# EasyEDA Pro project DC_MainBoard_Gh.eprj

# Schematic Schematic1
Board Name: Board1; Create Date: 2025-06-30; Page Name: P1; Project Name: DC_MainBoard_Gh; Schematic Name: Schematic1; Update Date: 2025-07-02; Company: EasyEDA.com; Page Size: A4; Version: V1.0
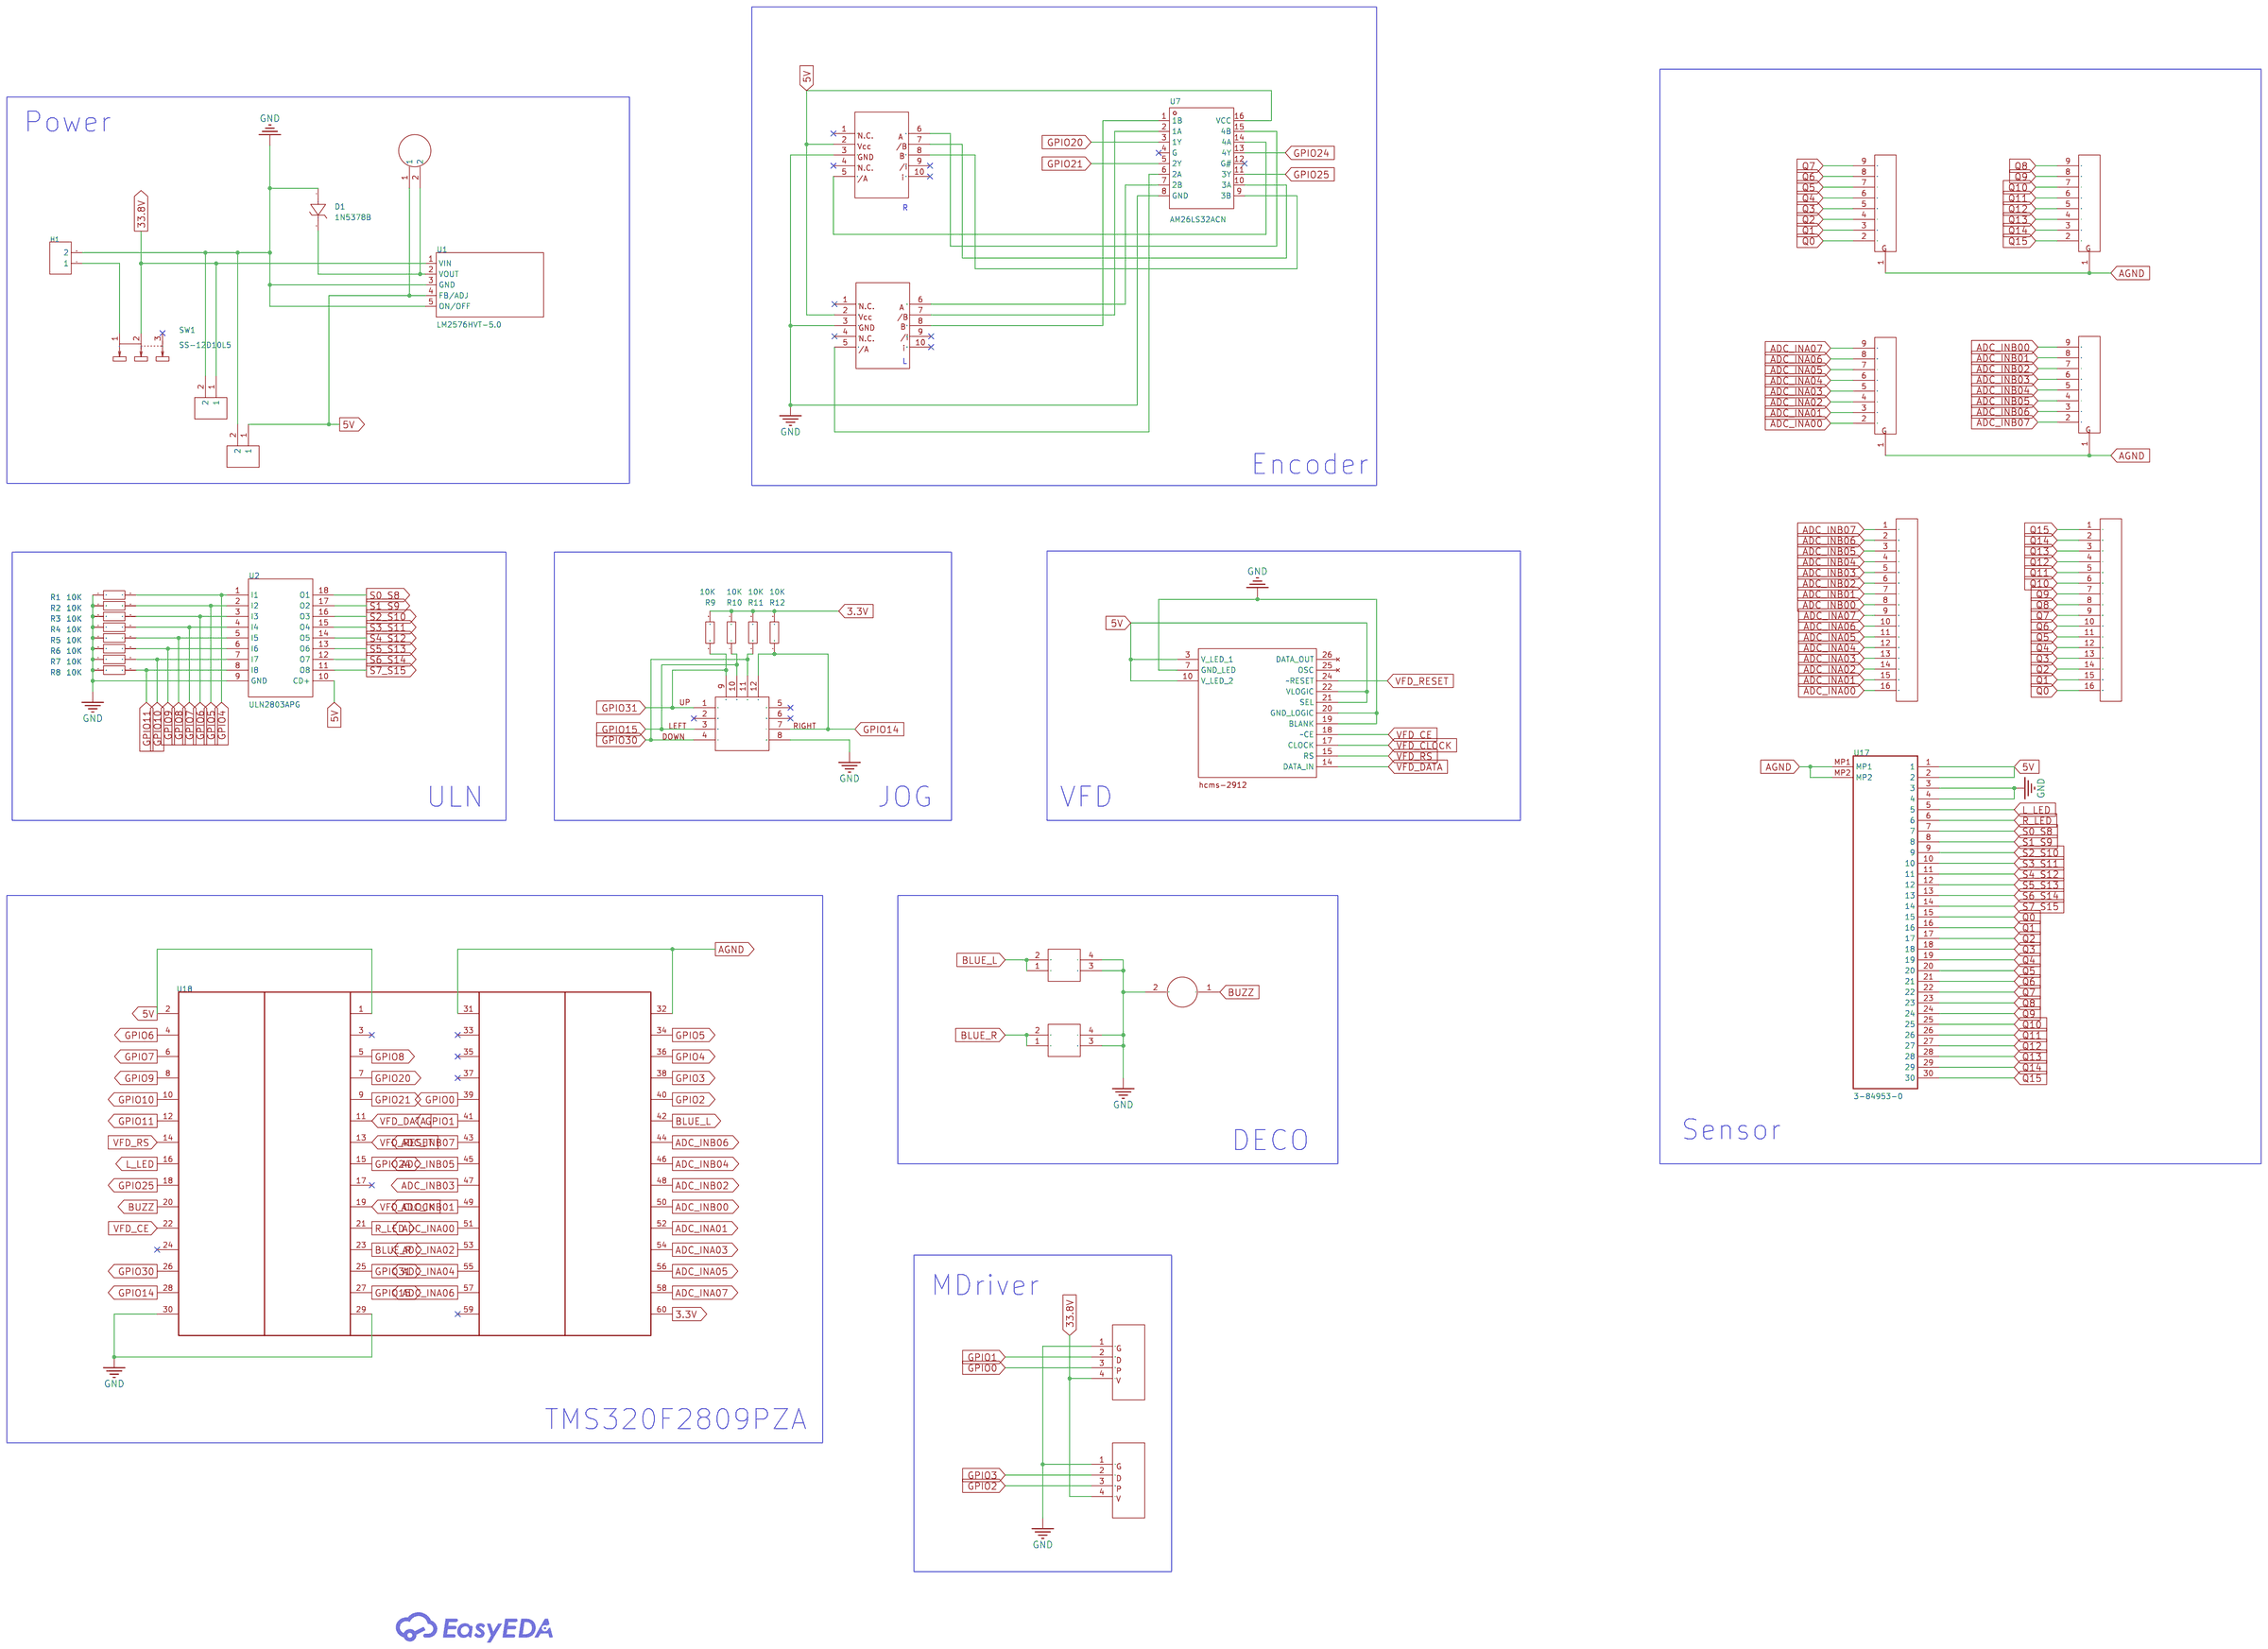
[diagram p0: schematic sheet]

## Parts
C1  -  [100uF Capacitor]
C2  -  [1000uF Capacitor]
D1  1N5378B  [DO-15_BD3.1-L6.7-P10.70-D0.9-FD]
H1  -  [HDR-TH_2P-P2.54-V-F]
L1  -  [Indoctor]
L2  -  [NEMO_LED]
L3  -  [NEMO_LED]
R1  10K  [R0603]
R2  10K  [R0603]
R3  10K  [R0603]
R4  10K  [R0603]
R5  10K  [R0603]
R6  10K  [R0603]
R7  10K  [R0603]
R8  10K  [R0603]
R9  10K  [R0603]
R10  10K  [R0603]
R11  10K  [R0603]
R12  10K  [R0603]
SW1  SS-12D10L5  [SW-TH_SS-12D10L5]
U1  LM2576HVT-5.0  [TO-220-5L_L10.2-W4.5-P1.71-L]
U2  ULN2803APG  [DIP-18_L23.0-W6.5-P2.54-LS7.6-BL]
U3  -  [JOG_SW_DIP]
U4  MDriver_L  [DC_Main_to_Motordriver_Connector_L]
U5  MDriver_R  [DC_Main_to_Motordriver_Connector_R]
U6  -  [BUZZER]
U7  AM26LS32ACN  [DIP-16_L20.0-W6.4-P2.54-LS7.6-BL]
U8  -  [Encoder]
U9  -  [Encoder]
U10  -  [HCMS-2912]
U11  -  [Array]
U12  -  [Array]
U13  -  [Array]
U14  -  [Array]
U15  -  [C_Array]
U16  -  [C_Array]
U17  3-84953-0  [3849530]
U18  -  [2809PCB]

## Library data of the parts
C1 = 100uF Capacitor
C2 = 1000uF Capacitor
D1 = 1N5378B: Supplier Part: C2988330; Manufacturer: EIC; Supplier Footprint: DO-15; JLCPCB Part Class: Extended Part; Datasheet: https://atta.szlcsc.com/upload/public/pdf/source/20220402/75CFD8A39FA764DF5610AA6DE4D072CD.pdf; Supplier: LCSC; Zener Voltage(Nom): 100V; Reverse Leakage Current (Ir): 500nA@76V; Pd - Power Dissipation: 5W; Impedance(Zzt): 90Ω
H1 = HDR-F_2.54_1x2P: Supplier Footprint: Through
L1 = Indoctor
L2 L3 = NEMO_LED
R1-R12 = Res_0603: Supplier Footprint: 0603
SW1 = SS-12D10L5: LCSC Part Name: 柄长5mm 直插双档 滑动开关; Supplier Part: C319012; Manufacturer: XKB Connectivity(中国星坤); Supplier Footprint: 插件; JLCPCB Part Class: Extended Part; Datasheet: https://atta.szlcsc.com/upload/public/pdf/source/20211009/D6412F37AABE6F9459A6EE7FA4DAEADB.pdf; Supplier: LCSC; Circuit: SPDT; Actuator Style: Rectangular columnar; Pin Style: PCPin; Switch Length: 13mm; Switch Width: 6.8mm; Switch Height: 6.4mm; Mounting Style: Straight; Actuator Color: Black; Current Rating (DC): 3A; Voltage Rating (DC): 125V; Current Rating (AC): 3A; Voltage Rating (AC): 125V; Mechanical Life: 1万次; Operating Temperature: -40℃~+85℃
U1 = LM2576HVT-5.0_C262789: Supplier Part: C262789; Manufacturer: HTC; Supplier Footprint: TO-220-5; JLCPCB Part Class: Extended Part; Datasheet: https://atta.szlcsc.com/upload/public/pdf/source/20191203/C126037_E42ABC3D16C6AA3446C45CA7229A4210.pdf; Supplier: LCSC; Function: Step-down type; Output Current: 3A; Frequency - Switching: 52kHz; Operating Temperature: -40℃~+125℃; Number of Outputs: 1; Topology: Step-down; Switch tube (built-in/external): Built-in
U2 = ULN2803APG: LCSC Part Name: 停产 ULN2803APG; Supplier Part: C5252; Manufacturer: TOSHIBA(东芝); Supplier Footprint: DIP-18; JLCPCB Part Class: Extended Part; Datasheet: https://atta.szlcsc.com/upload/public/pdf/source/20120920/1457706536068.pdf; Supplier: LCSC; number of channels: Eight channels
U3 = JOG_SW_DIP
U4 = DC_Main_to_Motordriver_Connector
U5 = DC_Main_to_Motordriver_Connector_R
U6 = BUZZER
U7 = AM26LS32ACN: LCSC Part Name: 四路差分线接收器; Supplier Part: C29912; Manufacturer: TI(德州仪器); Supplier Footprint: DIP-16; JLCPCB Part Class: Extended Part; Datasheet: https://www.ti.com/cn/lit/gpn/am26ls32ac; Supplier: LCSC; Type: Receivers; Number of Drivers: 0; Number of Receivers: 4; Voltage - Supply: 4.75V~5.25V; Operating Temperature: 0℃~+70℃
U8 U9 = Encoder
U10 = HCMS-2912
U11-U14 = Array
U15 U16 = C_Array
U17 = 3-84953-0
U18 = TMS320F2809PZA_DIP

## Nets
3.3V: R9.2 R10.2 R11.2 R12.2 U18.60
5V: C2.1 L1.1 U1.4(FB/ADJ) U2.10(CD+) U7.16(VCC) U8.2 U9.2 U10.3(V_LED_1) U10.10(V_LED_2) U10.21(SEL) U10.22(VLOGIC) U17.1 U17.2 U18.1 U18.2
33.8V: C1.1 SW1.2 U1.1(VIN) U4.4 U5.4
AGND: U11.1 U12.1 U13.1 U14.1 U17.MP1 U17.MP2 U18.31 U18.32
GND: C1.2 C2.2 D1.1(+) H1.2 L2.3 L2.4 L3.3 L3.4 R1.1 R2.1 R3.1 R4.1 R5.1 R6.1 R7.1 R8.1 U1.3(GND) U1.5(ON/OFF) U2.9(GND) U3.8 U4.1 U5.1 U6.2 U7.8(GND) U8.3 U9.3 U10.7(GND_LED) U10.19(BLANK) U10.20(GND_LOGIC) U17.3 U17.4 U18.29 U18.30
ADC_INA00: U13.2 U15.16 U18.51
ADC_INA01: U13.3 U15.15 U18.52
ADC_INA02: U13.4 U15.14 U18.53
ADC_INA03: U13.5 U15.13 U18.54
ADC_INA04: U13.6 U15.12 U18.55
ADC_INA05: U13.7 U15.11 U18.56
ADC_INA06: U13.8 U15.10 U18.57
ADC_INA07: U13.9 U15.9 U18.58
ADC_INB00: U14.9 U15.8 U18.50
ADC_INB01: U14.8 U15.7 U18.49
ADC_INB02: U14.7 U15.6 U18.48
ADC_INB03: U14.6 U15.5 U18.47
ADC_INB04: U14.5 U15.4 U18.46
ADC_INB05: U14.4 U15.3 U18.45
ADC_INB06: U14.3 U15.2 U18.44
ADC_INB07: U14.2 U15.1 U18.43
BLUE_L: L2.1 L2.2 U18.42
BLUE_R: L3.1 L3.2 U18.23
BUZZ: U6.1 U18.20
GPIO0: U4.3 U18.39
GPIO1: U4.2 U18.41
GPIO2: U5.3 U18.40
GPIO3: U5.2 U18.38
GPIO4: R1.2 U2.1(I1) U18.36
GPIO5: R2.2 U2.2(I2) U18.34
GPIO6: R3.2 U2.3(I3) U18.4
GPIO7: R4.2 U2.4(I4) U18.6
GPIO8: R5.2 U2.5(I5) U18.5
GPIO9: R6.2 U2.6(I6) U18.8
GPIO10: R7.2 U2.7(I7) U18.10
GPIO11: R8.2 U2.8(I8) U18.12
GPIO14: R12.1 U3.7 U3.12 U18.28
GPIO15: R10.1 U3.3 U3.10 U18.27
GPIO20: U7.3(1Y) U18.7
GPIO21: U7.5(2Y) U18.9
GPIO24: U7.13(4Y) U18.15
GPIO25: U7.11(3Y) U18.18
GPIO30: R11.1 U3.4 U3.11 U18.26
GPIO31: R9.1 U3.1 U3.9 U18.25
L_LED: U17.5 U18.16
Q0: U11.2 U16.16 U17.15
Q1: U11.3 U16.15 U17.16
Q2: U11.4 U16.14 U17.17
Q3: U11.5 U16.13 U17.18
Q4: U11.6 U16.12 U17.19
Q5: U11.7 U16.11 U17.20
Q6: U11.8 U16.10 U17.21
Q7: U11.9 U16.9 U17.22
Q8: U12.9 U16.8 U17.23
Q9: U12.8 U16.7 U17.24
Q10: U12.7 U16.6 U17.25
Q11: U12.6 U16.5 U17.26
Q12: U12.5 U16.4 U17.27
Q13: U12.4 U16.3 U17.28
Q14: U12.3 U16.2 U17.29
Q15: U12.2 U16.1 U17.30
R_LED: U17.6 U18.21
S0_S8: U2.18(O1) U17.7
S1_S9: U2.17(O2) U17.8
S2_S10: U2.16(O3) U17.9
S3_S11: U2.15(O4) U17.10
S4_S12: U2.14(O5) U17.11
S5_S13: U2.13(O6) U17.12
S6_S14: U2.12(O7) U17.13
S7_S15: U2.11(O8) U17.14
VFD_CE: U10.18(~CE) U18.22
VFD_CLOCK: U10.17(CLOCK) U18.19
VFD_DATA: U10.14(DATA_IN) U18.11
VFD_RESET: U10.24(~RESET) U18.13
VFD_RS: U10.15(RS) U18.14
$1N296: H1.1 SW1.1
$1N711: D1.2(-) L1.2 U1.2(VOUT)
$1N3260: U7.14(4A) U9.5
$1N3267: U7.15(4B) U9.6
$1N3308: U7.10(3A) U9.7
$1N3319: U7.9(3B) U9.8
$1N3376: U7.6(2A) U8.5
$1N3383: U7.7(2B) U8.6
$1N3391: U7.2(1A) U8.7
$1N3400: U7.1(1B) U8.8

Not connected (* = marked no-connect by the designer): SW1 3*; U3 2* 5* 6*; U7 4(G)* 12(G#)*; U8 1* 4* 9* 10*; U9 1* 4* 9* 10*; U10 25(OSC) 26(DATA_OUT); U18 3* 17* 24* 33* 35* 37* 59*

## Notes on the sheet
- Power
- R
- L
- Encoder
- ULN
- JOG
- VFD
- Sensor
- DECO
- MDriver
- TMS320F2809PZA

# Board PCB1
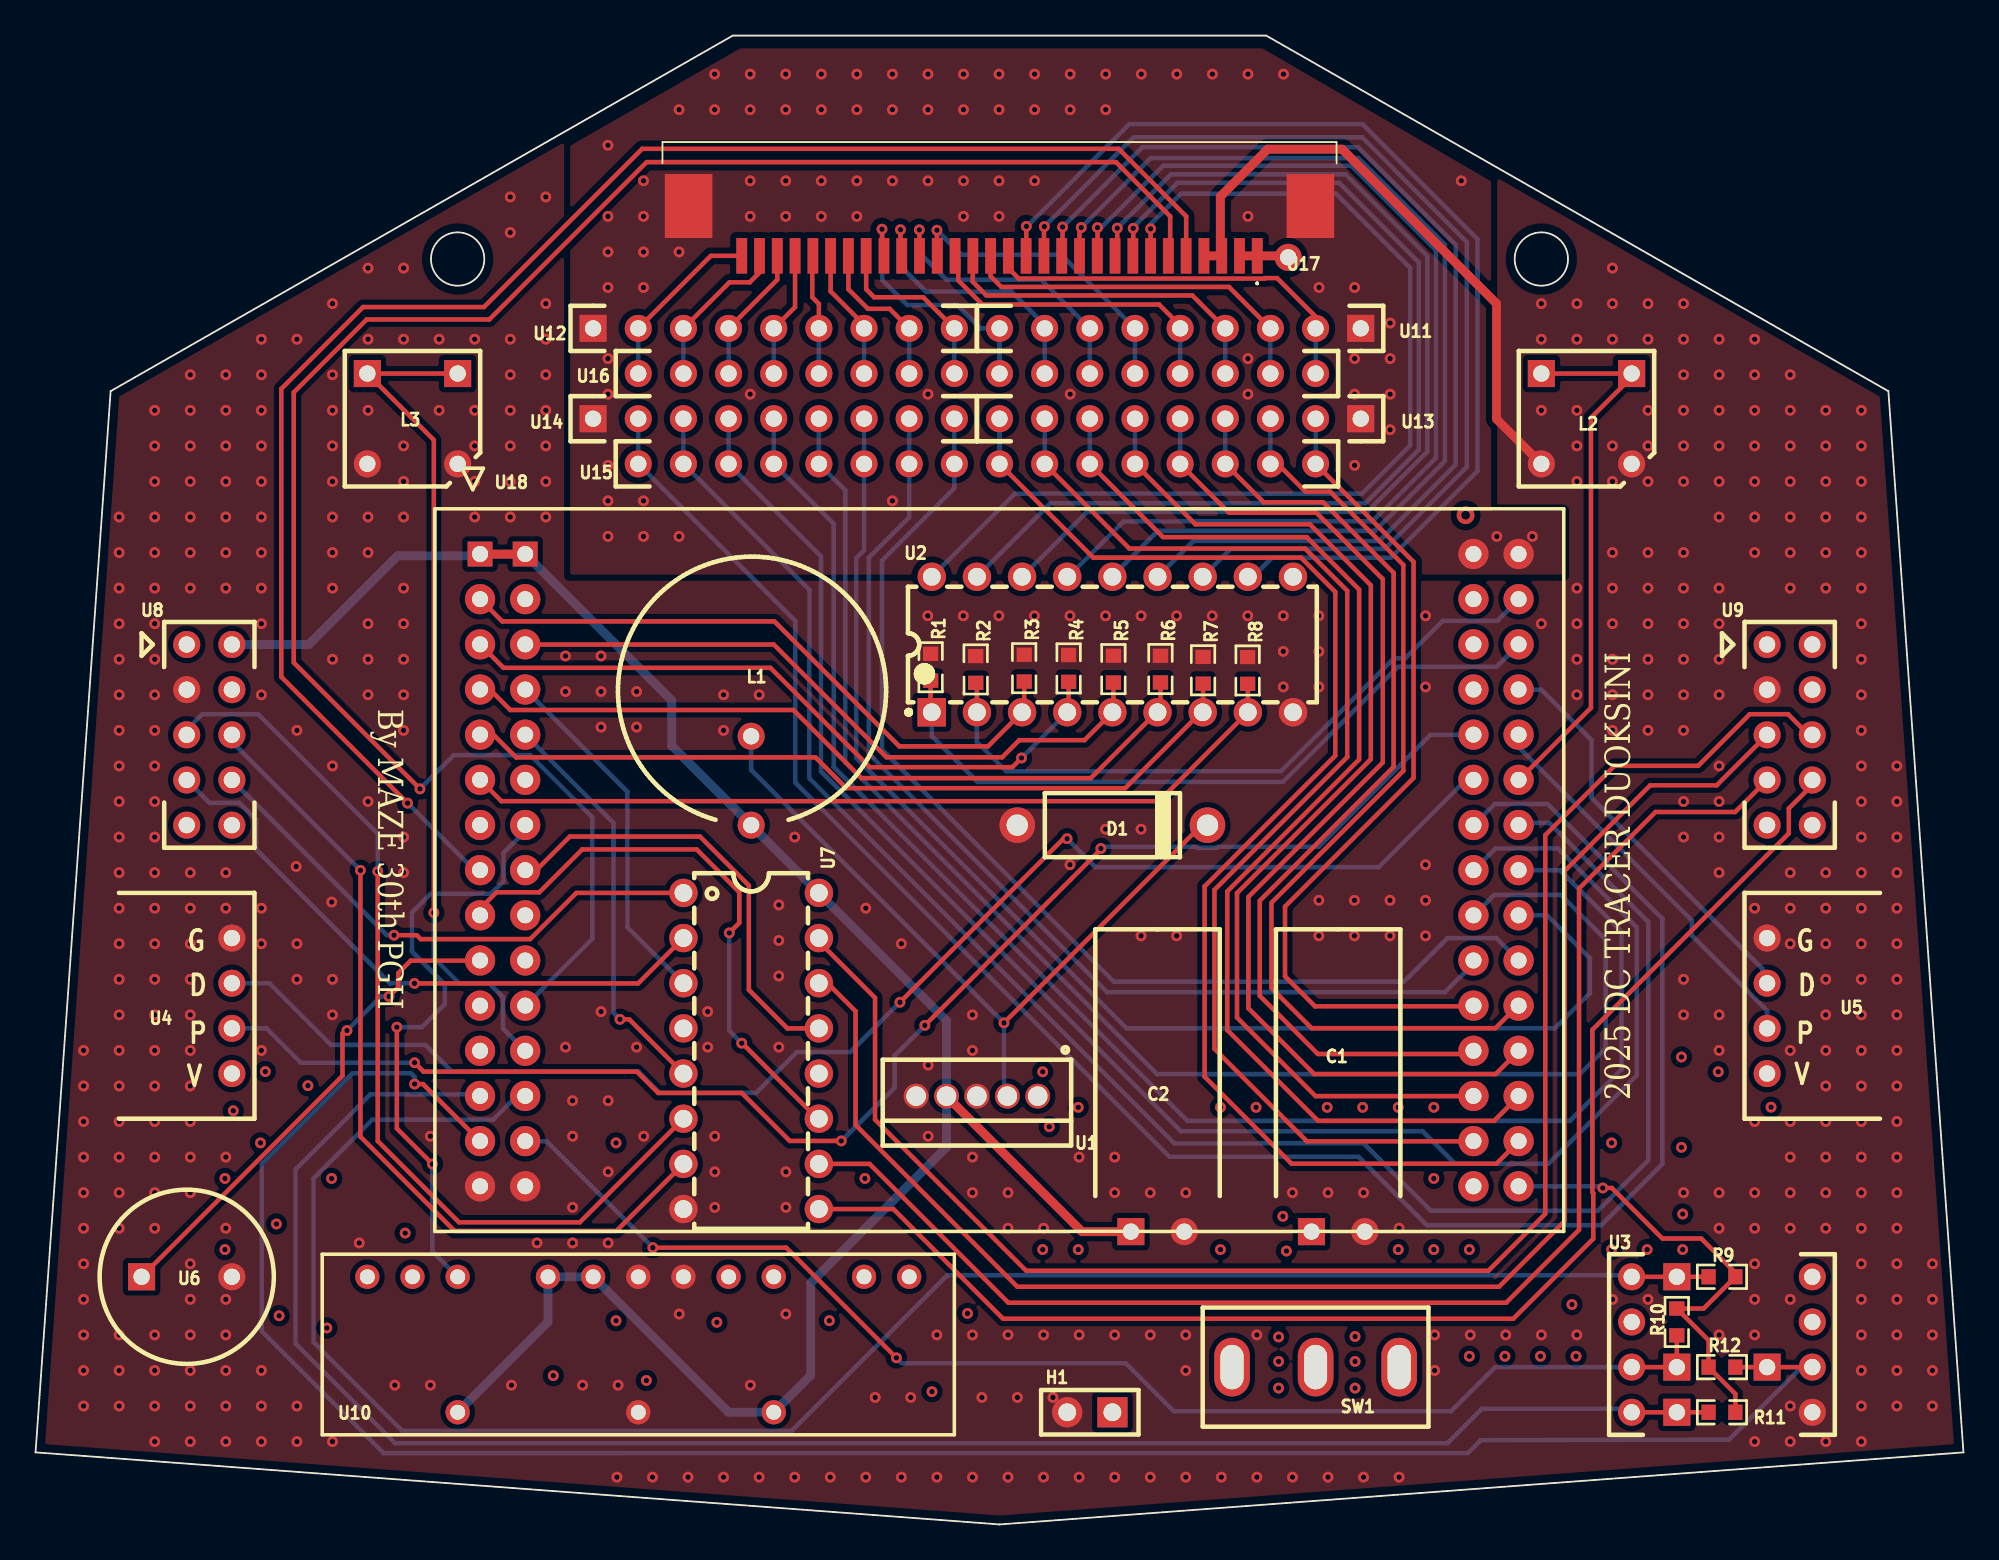
[diagram p1: board, top side]
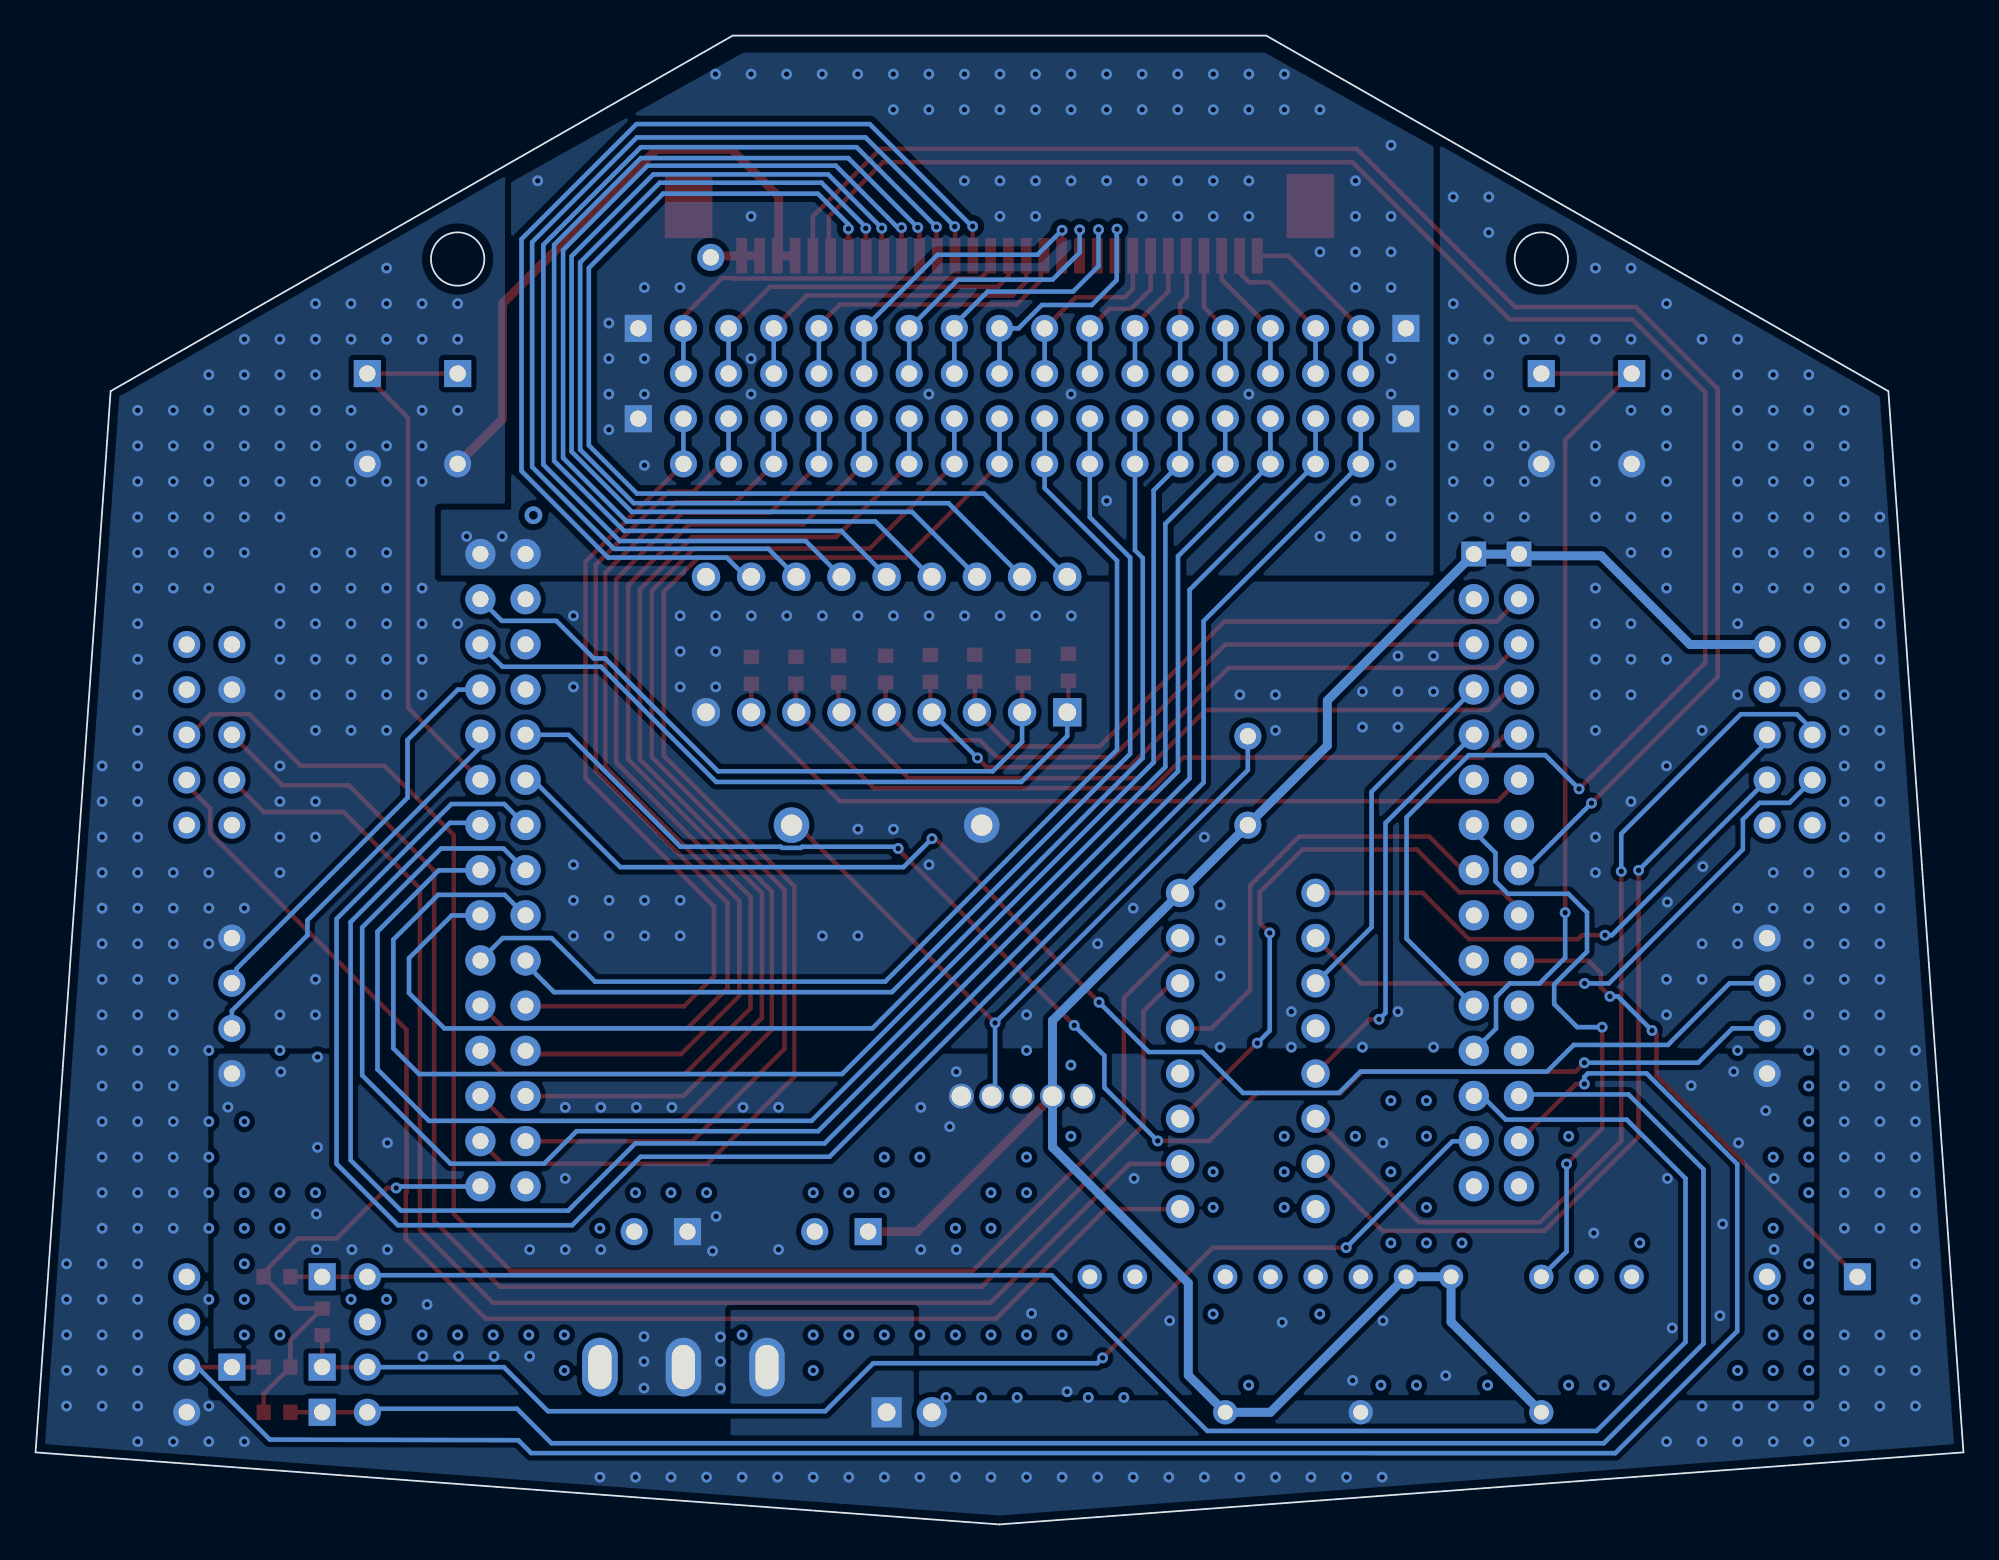
[diagram p2: board, bottom side, seen from below]

Outline 108.45 x 83.74 mm; copper layers: Top Layer, Inner1, Inner2, Bottom Layer. Coordinates in mm from the lower left corner of the outline.
Outline path: circle c23.74,71.17 r1.5 ; circle c84.7,71.17 r1.5 ; 0,4.05 4.22,63.74 39.22,83.74 69.22,83.74 104.22,63.74 108.45,4.05 54.22,0 0,4.05
Stack: Top Layer 0.035mm Outer layer thickness 1oz / Dielectric1 0.2104mm 7628 RC49% 8.6mil / Inner1 0.0152mm Inner layer thickness / Dielectric2 1.065mm 1.1mm H/HOZ Copper / Inner2 0.0152mm Inner layer thickness / Dielectric3 0.2104mm 7628 RC49% 8.6mil / Bottom Layer 0.035mm Outer layer thickness 1oz

## Design rules (mm)
template: Custom Config
spacing copperThickness1oz (default): track to track 0.102, other pairs 0.152 to 0.3
spacing copperThickness2oz: track to track 0.203, other pairs 0.152 to 0.3
track width copperThickness1oz (default): min 0.127, default 0.254, max 2.54
track width copperThickness2oz: min 0.203, default 0.254, max 2.54
track width 5V: min 0.2, default 0.5, max 1
differential pair differentialPair (default): width min 0.127, default 0.254, max 2.54; gap min 0.152, default 0.152
via viaSize (default): diameter min 0.5, default 0.61, max 10; hole min 0.3, default 0.305, max 6.3
net 5V uses 5V

## Placement (name value [footprint] x y rotation side)
C1  -  [100uF Capacitor]  73.27 16.47 0 top
C2  -  [1000uF Capacitor]  63.11 16.47 0 top
D1  1N5378B  [DO-15_BD3.1-L6.7-P10.70-D0.9-FD]  60.57 39.33 0 top
H1  -  [HDR-TH_2P-P2.54-V-F]  59.3 6.31 180 top
L1  -  [Indoctor]  40.25 39.33 0 top
L2  -  [NEMO_LED]  87.24 59.65 0 top
L3  -  [NEMO_LED]  21.2 59.65 0 top
NOREF  -  [Pad_e3913]  70.46 71.26 0 top
R1  10K  [R0603]  50.35 48.21 270 top
R2  10K  [R0603]  52.89 48.09 270 top
R3  10K  [R0603]  55.61 48.16 270 top
R4  10K  [R0603]  58.11 48.14 270 top
R5  10K  [R0603]  60.63 48.1 270 top
R6  10K  [R0603]  63.28 48.11 270 top
R7  10K  [R0603]  65.68 48.04 270 top
R8  10K  [R0603]  68.18 48.03 270 top
R9  10K  [R0603]  94.86 13.93 0 top
R10  10K  [R0603]  92.32 11.39 90 top
R11  10K  [R0603]  94.86 6.31 0 top
R12  10K  [R0603]  94.86 8.85 180 top
SW1  SS-12D10L5  [SW-TH_SS-12D10L5]  72 8.85 0 top
U1  LM2576HVT-5.0  [TO-220-5L_L10.2-W4.5-P1.71-L]  52.95 24.09 180 top
U2  ULN2803APG  [DIP-18_L23.0-W6.5-P2.54-LS7.6-BL]  60.57 49.49 0 top
U3  -  [JOG_SW_DIP]  94.86 8.85 0 top
U4  MDriver_L  [DC_Main_to_Motordriver_Connector_L]  8.5 29.17 0 top
U5  MDriver_R  [DC_Main_to_Motordriver_Connector_R]  99.94 29.17 0 top
U6  -  [BUZZER]  8.5 13.93 0 top
U7  AM26LS32ACN  [DIP-16_L20.0-W6.4-P2.54-LS7.6-BL]  40.25 26.63 270 top
U8  -  [Encoder]  8.5 39.33 0 top
U9  -  [Encoder]  97.4 39.33 0 top
U10  -  [HCMS-2912]  23.74 6.31 0 top
U11  -  [Array]  74.54 67.27 180 top
U12  -  [Array]  31.36 67.27 0 top
U13  -  [Array]  74.54 62.19 180 top
U14  -  [Array]  31.36 62.19 0 top
U15  -  [C_Array]  33.9 59.65 0 top
U16  -  [C_Array]  33.9 64.73 0 top
U17  3-84953-0  [3849530]  54.22 72.35 180 top
U18  TMS320F2809PZA_DIP  [2809PCB]  25 54.58 0 top

## Footprints (pads in the part's own frame, mm; a bottom-side part is the same pattern mirrored in y, then rotated)
100uF Capacitor
  rect 1.524x1.524 hole 0.914: 1(-1.5,0)
  round 1.524 hole 0.914: 2(1.5,0)
1000uF Capacitor
  rect 1.524x1.524 hole 0.914: 1(-1.5,0)
  round 1.524 hole 0.914: 2(1.5,0)
2809PCB
  rect 1.4x1.4 hole 0.9: 1(2.54,0) 2(0,0)
  round 1.7 hole 0.9: 3(2.54,-2.54) 4(0,-2.54) 5(2.54,-5.08) 6(0,-5.08) 7(2.54,-7.62) 8(0,-7.62) 9(2.54,-10.16) 10(0,-10.16) 11(2.54,-12.7) 12(0,-12.7) 13(2.54,-15.24) 14(0,-15.24) 15(2.54,-17.78) 16(0,-17.78) 17(2.54,-20.32) 18(0,-20.32) 19(2.54,-22.86) 20(0,-22.86) 21(2.54,-25.4) 22(0,-25.4) 23(2.54,-27.94) 24(0,-27.94) 25(2.54,-30.48) 26(0,-30.48) 27(2.54,-33.02) 28(0,-33.02) 29(2.54,-35.56) 30(0,-35.56) 31(55.88,0) 32(58.42,0) 33(55.88,-2.54) 34(58.42,-2.54) 35(55.88,-5.08) 36(58.42,-5.08) 37(55.88,-7.62) 38(58.42,-7.62) 39(55.88,-10.16) 40(58.42,-10.16) 41(55.88,-12.7) 42(58.42,-12.7) 43(55.88,-15.24) 44(58.42,-15.24) 45(55.88,-17.78) 46(58.42,-17.78) 47(55.88,-20.32) 48(58.42,-20.32) 49(55.88,-22.86) 50(58.42,-22.86) 51(55.88,-25.4) 52(58.42,-25.4) 53(55.88,-27.94) 54(58.42,-27.94) 55(55.88,-30.48) 56(58.42,-30.48) 57(55.88,-33.02) 58(58.42,-33.02) 59(55.88,-35.56) 60(58.42,-35.56)
3849530
  rect 0.61x2 smd: 1(-14.5,1) 2(-13.5,1) 3(-12.5,1) 4(-11.5,1) 5(-10.5,1) 6(-9.5,1) 7(-8.5,1) 8(-7.5,1) 9(-6.5,1) 10(-5.5,1) 11(-4.5,1) 12(-3.5,1) 13(-2.5,1) 14(-1.5,1) 15(-0.5,1) 16(0.5,1) 17(1.5,1) 18(2.5,1) 19(3.5,1) 20(4.5,1) 21(5.5,1) 22(6.5,1) 23(7.5,1) 24(8.5,1) 25(9.5,1) 26(10.5,1) 27(11.5,1) 28(12.5,1) 29(13.5,1) 30(14.5,1)
  rect 2.68x3.6 smd: MP1(-17.49,-1.8) MP2(17.49,-1.8)
Array
  rect 1.524x1.524 hole 0.914: 1(0,0)
  round 1.524 hole 0.914: 2(2.54,0) 3(5.08,0) 4(7.62,0) 5(10.16,0) 6(12.7,0) 7(15.24,0) 8(17.78,0) 9(20.32,0)
BUZZER
  rect 1.524x1.524 hole 0.914: 1(-2.54,0)
  round 1.524 hole 0.914: 2(2.54,0)
C_Array
  round 1.524 hole 0.914: 1(0,0) 2(2.54,0) 3(5.08,0) 4(7.62,0) 5(10.16,0) 6(12.7,0) 7(15.24,0) 8(17.78,0) 9(20.32,0) 10(22.86,0) 11(25.4,0) 12(27.94,0) 13(30.48,0) 14(33.02,0) 15(35.56,0) 16(38.1,0)
DC_Main_to_Motordriver_Connector_L
  round 1.524 hole 0.914: 1(2.54,3.81) 2(2.54,1.27) 3(2.54,-1.27) 4(2.54,-3.81)
DC_Main_to_Motordriver_Connector_R
  round 1.524 hole 0.914: 1(-2.54,3.81) 2(-2.54,1.27) 3(-2.54,-1.27) 4(-2.54,-3.81)
DIP-16_L20.0-W6.4-P2.54-LS7.6-BL
  round 1.6 hole 1: 1(-8.89,-3.81) 2(-6.35,-3.81) 3(-3.81,-3.81) 4(-1.27,-3.81) 5(1.27,-3.81) 6(3.81,-3.81) 7(6.35,-3.81) 8(8.89,-3.81) 9(8.89,3.81) 10(6.35,3.81) 11(3.81,3.81) 12(1.27,3.81) 13(-1.27,3.81) 14(-3.81,3.81) 15(-6.35,3.81) 16(-8.89,3.81)
DIP-18_L23.0-W6.5-P2.54-LS7.6-BL
  rect 1.6x1.6 hole 1: 1(-10.16,-3.81)
  round 1.6 hole 1: 2(-7.62,-3.81) 3(-5.08,-3.81) 4(-2.54,-3.81) 5(0,-3.81) 6(2.54,-3.81) 7(5.08,-3.81) 8(7.62,-3.81) 9(10.16,-3.81) 10(10.16,3.81) 11(7.62,3.81) 12(5.08,3.81) 13(2.54,3.81) 14(0,3.81) 15(-2.54,3.81) 16(-5.08,3.81) 17(-7.62,3.81) 18(-10.16,3.81)
DO-15_BD3.1-L6.7-P10.70-D0.9-FD
  round 2 hole 1.2: 1(-5.35,0) 2(5.35,0)
Encoder
  round 1.524 hole 0.914: 1(0,10.16) 2(2.54,10.16) 3(0,7.62) 4(2.54,7.62) 5(0,5.08) 6(2.54,5.08) 7(0,2.54) 8(2.54,2.54) 9(0,0) 10(2.54,0)
HCMS-2912
  round 1.365 hole 0.84: 3(0,0) 7(10.16,0) 10(17.78,0) 14(25.4,7.62) 15(22.86,7.62) 17(17.78,7.62) 18(15.24,7.62) 19(12.7,7.62) 20(10.16,7.62) 21(7.62,7.62) 22(5.08,7.62) 24(0,7.62) 25(-2.54,7.62) 26(-5.08,7.62)
HDR-TH_2P-P2.54-V-F
  rect 1.7x1.7 hole 1: 1(-1.27,0)
  round 1.7 hole 1: 2(1.27,0)
Indoctor
  round 1.524 hole 0.914: 1(0,0) 2(0,5)
JOG_SW_DIP
  round 1.524 hole 0.914: 1(-5.08,5.08) 2(-5.08,2.54) 3(-5.08,0) 4(-5.08,-2.54) 5(5.08,5.08) 6(5.08,2.54) 7(5.08,0) 8(5.08,-2.54)
  rect 1.524x1.524 hole 0.914: 9(-2.54,5.08) 10(-2.54,0) 11(-2.54,-2.54) 12(2.54,0)
NEMO_LED
  rect 1.524x1.524 hole 0.914: 1(-2.54,5.08) 2(2.54,5.08)
  round 1.524 hole 0.914: 3(-2.54,0) 4(2.54,0)
Pad_e3913
  round 1.524 hole 0.914: 1(0,0)
R0603
  rect 0.806x0.864 smd: 1(-0.753,0) 2(0.753,0)
SW-TH_SS-12D10L5
  oval 2x3.3 hole 1.3x2.5: 1(-4.7,0) 2(0,0) 3(4.7,0)
TO-220-5L_L10.2-W4.5-P1.71-L
  round 1.4 hole 1.1: 1(-3.42,0) 2(-1.71,0) 3(0,0) 4(1.71,0) 5(3.42,0)

## Nets
As in the schematic, except:
5V: C2.1 L1.1 NOREF.1 U1.4 U2.10 U7.16 U8.2 U9.2 U10.3 U10.10 U10.21 U10.22 U17.1 U17.2 U18.1 U18.2

Pads without a net: SW1 3; U3 2 5 6; U7 4 12; U8 1 4 9 10; U9 1 4 9 10; U10 25 26; U18 3 17 24 33 35 37 59

## Via types
v1: diameter 0.61, hole 0.305, Top Layer to Bottom Layer, 678 vias
v2: diameter 1, hole 0.5, Top Layer to Bottom Layer, 1 via

## Routing (per net, layer and track width the routed paths; a pad name or vN(x,y) marks a point on that pad's centre or on a via; arc(x,y) is an arc through that point)
3.3V: length 25.7
  Top Layer w0.254: v1(88.16,18.92) 88.67,18.92 91.51,16.08 93.7,16.08 95.62,14.16 R9.2 93.83,12.14 R10.2 94.11,10.36 R12.2 95.62,7.34 R11.2
  Bottom Layer w0.254: 83.43,19.01 88.07,19.01 v1(88.16,18.92)
5V: length 228.7
  Top Layer w0.5: U17.2 U17.1 70.38,71.35 NOREF.1 ; U1.4 58.86,16.47 C2.1 ; 25.01,54.57 27.55,54.57
  Inner2 w0.5: v2(80.44,56.76) 73.72,56.76 70.73,53.77 U2.10 72.81,53.3 76.28,49.83 76.28,44.86 66.94,35.52 U7.16 ; v2(80.44,56.76) 92.67,56.76 U9.2 ; v2(80.44,56.76) 80.44,66.16 75.27,71.33 70.53,71.33 NOREF.1
  Bottom Layer w0.5: U10.3 28.82,11.39 U10.22 U10.21 38.98,6.31 U10.10 43.6,8.39 43.6,13.58 51.24,21.22 U1.4 51.24,28.34 U7.16 L1.1 35.78,43.8 35.78,46.34 27.55,54.57 25.01,54.57 24.92,54.48 20.37,54.48 15.38,49.49 U8.2
33.8V:
  vias: v1(10.65,19.46) v1(10.65,15.46) v1(11.12,23.27) v1(12.65,21.46) v1(12.92,25.47) v1(13.55,16.9) v1(13.7,11.74) v1(15.32,24.68) v1(16.39,11.05) v1(16.65,19.46) v1(20.79,16.39) v1(29.12,8.37) v1(32.65,21.46) v1(32.65,11.46) v1(34.36,8.1) v1(38.32,11.37) v1(44.65,11.46) v1(46.65,19.46) v1(50.42,7.47) v1(52.42,11.87) v1(56.65,25.46) v1(56.65,15.46) v1(57.02,22.37) v1(58.65,23.46) v1(58.65,15.46) v1(66.65,23.46) v1(66.65,15.46) v1(68.65,23.46) v1(69.92,10.55) v1(69.92,9.17) v1(69.92,7.67) v1(70.16,17.33) v1(70.36,15.38) v1(72.65,23.46) v1(74.22,10.57) v1(74.22,9.17) v1(74.22,7.67) v1(74.65,23.46) v1(76.65,23.46) v1(76.65,15.46) v1(78.65,23.46) v1(78.65,19.46) v1(78.65,15.46) v1(80.65,15.46) v1(80.65,9.46) v1(82.65,9.46) v1(84.65,9.46) v1(86.42,12.37) v1(86.65,9.46) v1(88.65,21.46) v1(88.65,15.46) v1(90.65,15.46) v1(92.59,26.29) v1(92.59,21.21) v1(92.65,17.46) v1(92.65,15.46) v1(94.65,25.46) v1(97.62,23.47)
AGND:
  vias: v1(32.2,77.57) v1(32.2,73.57) v1(32.2,71.57) v1(32.2,69.57) v1(32.2,65.57) v1(32.2,63.57) v1(32.2,59.57) v1(32.2,57.57) v1(32.2,55.57) v1(34.2,75.57) v1(34.2,73.57) v1(34.2,71.57) v1(34.2,69.57) v1(34.2,57.57) v1(34.2,55.57) v1(36.2,79.57) v1(36.2,71.57) v1(36.2,55.57) v1(38.2,81.57) v1(38.2,79.57) v1(40.2,81.57) v1(40.2,79.57) v1(40.2,75.57) v1(40.2,73.57) v1(40.2,63.57) v1(42.2,81.57) v1(42.2,79.57) v1(42.2,75.57) v1(42.2,73.57) v1(44.2,81.57) v1(44.2,79.57) v1(44.2,75.57) v1(44.2,73.57) v1(46.2,81.57) v1(46.2,79.57) v1(46.2,75.57) v1(46.2,73.57) v1(48.2,81.57) v1(48.2,79.57) v1(48.2,75.57) v1(48.2,57.57) v1(50.2,81.57) v1(50.2,79.57) v1(50.2,75.57) v1(50.2,63.57) v1(52.2,81.57) v1(52.2,79.57) v1(52.2,75.57) v1(52.2,73.57) v1(54.2,81.57) v1(54.2,79.57) v1(54.2,75.57) v1(54.2,73.57) v1(56.2,81.57) v1(56.2,79.57) v1(56.2,75.57) v1(58.2,81.57) v1(58.2,79.57) v1(58.2,63.57) v1(60.2,81.57) v1(60.2,79.57) v1(62.2,81.57) v1(64.2,81.57) v1(66.2,81.57) v1(68.2,81.57) v1(68.2,73.57) v1(68.2,65.57) v1(68.2,63.57) v1(70.2,81.57) v1(72.2,69.57) v1(74.2,69.57) v1(74.2,65.57) v1(74.2,63.57) v1(74.2,59.57) v1(76.2,67.57) v1(76.2,65.57) v1(76.2,63.57) v1(76.2,61.57) v1(80.2,75.57) v1(82.2,55.57) v1(84.2,55.57)
GND: length 34.7
  Top Layer w0.5: L2.3 82.18,62.17 82.18,68.66 73.49,77.35 69.31,77.35 66.65,74.68 66.65,71.43 U17.3 U17.4
  vias: v1(2.7,26.66) v1(2.7,24.66) v1(2.7,22.66) v1(2.7,20.66) v1(2.7,18.66) v1(2.7,16.66) v1(2.7,14.66) v1(2.7,12.66) v1(2.7,10.66) v1(2.7,8.66) v1(2.7,6.66) v1(4.7,56.66) v1(4.7,54.66) v1(4.7,52.66) v1(4.7,50.66) v1(4.7,48.66) v1(4.7,46.66) v1(4.7,44.66) v1(4.7,42.66) v1(4.7,40.66) v1(4.7,38.66) v1(4.7,36.66) v1(4.7,34.66) v1(4.7,32.66) v1(4.7,30.66) v1(4.7,28.66) v1(4.7,26.66) v1(4.7,24.66) v1(4.7,22.66) v1(4.7,20.66) v1(4.7,18.66) v1(4.7,16.66) v1(4.7,10.66) v1(4.7,8.66) v1(4.7,6.66) v1(6.7,62.66) v1(6.7,60.66) v1(6.7,58.66) v1(6.7,56.66) v1(6.7,54.66) v1(6.7,52.66) v1(6.7,50.66) v1(6.7,48.66) v1(6.7,46.66) v1(6.7,44.66) v1(6.7,42.66) v1(6.7,40.66) v1(6.7,38.66) v1(6.7,36.66) v1(6.7,34.66) v1(6.7,32.66) v1(6.7,30.66) v1(6.7,28.66) v1(6.7,26.66) v1(6.7,24.66) v1(6.7,22.66) v1(6.7,20.66) v1(6.7,18.66) v1(6.7,16.66) v1(6.7,10.66) v1(6.7,8.66) v1(6.7,6.66) v1(6.7,4.66) v1(8.7,64.66) v1(8.7,62.66) v1(8.7,60.66) v1(8.7,58.66) v1(8.7,56.66) v1(8.7,54.66) v1(8.7,52.66) v1(8.7,36.66) v1(8.7,34.66) v1(8.7,32.66) v1(8.7,30.66) v1(8.7,28.66) v1(8.7,26.66) v1(8.7,24.66) v1(8.7,22.66) v1(8.7,20.66) v1(8.7,18.66) v1(8.7,14.66) v1(8.7,12.66) v1(8.7,10.66) v1(8.7,8.66) v1(8.7,6.66) v1(8.7,4.66) v1(10.7,64.66) v1(10.7,62.66) v1(10.7,60.66) v1(10.7,58.66) v1(10.7,56.66) v1(10.7,54.66) v1(10.7,52.66) v1(10.7,36.66) v1(10.7,34.66) v1(10.7,20.66) v1(10.7,16.66) v1(10.7,12.66) v1(10.7,10.66) v1(10.7,8.66) v1(10.7,6.66) v1(10.7,4.66) v1(12.7,66.66) v1(12.7,64.66) v1(12.7,62.66) v1(12.7,60.66) v1(12.7,58.66) v1(12.7,56.66) v1(12.7,54.66) v1(12.7,52.66) v1(12.7,50.66) v1(12.7,46.66) v1(12.7,34.66) v1(12.7,32.66) v1(12.7,26.66) v1(12.7,8.66) v1(12.7,6.66) v1(12.7,4.66) v1(14.66,37) v1(14.7,66.66) v1(14.7,44.66) v1(14.7,32.66) v1(14.7,30.66) v1(14.7,6.66) v1(14.7,4.66) v1(16.66,35) v1(16.7,68.66) v1(16.7,64.66) v1(16.7,62.66) v1(16.7,60.66) v1(16.7,58.66) v1(16.7,56.66) v1(16.7,54.66) v1(16.7,52.66) v1(16.7,48.66) v1(16.7,42.66) v1(16.7,30.66) v1(16.7,28.66) v1(16.7,4.66) v1(18.21,15.83) v1(18.7,70.66) v1(18.7,66.66) v1(18.7,62.66) v1(18.7,56.66) v1(18.7,54.66) v1(18.7,50.66) v1(18.7,48.66) v1(18.7,46.66) v1(18.7,40.66) v1(20.21,7.83) v1(20.7,70.66) v1(20.7,66.66) v1(20.7,60.66) v1(20.7,58.66) v1(20.7,56.66) v1(20.7,52.66) v1(20.7,50.66) v1(20.7,48.66) v1(20.7,46.66) v1(20.7,44.66) v1(20.7,38.66) v1(20.7,36.66) v1(22.21,21.83) v1(22.21,7.83) v1(22.7,66.66) v1(22.7,62.66) v1(24.7,66.66) v1(24.7,62.66) v1(24.7,60.66) v1(24.7,58.66) v1(24.7,56.66) v1(26.7,74.66) v1(26.7,72.66) v1(26.7,66.66) v1(26.7,64.66) v1(26.7,62.66) v1(26.7,60.66) v1(26.7,58.66) v1(26.7,56.66) v1(26.77,7.83) v1(28.21,15.83) v1(28.7,74.66) v1(28.7,68.66) v1(28.7,66.66) v1(28.7,64.66) v1(28.7,62.66) v1(28.7,60.66) v1(28.7,58.66) v1(28.7,56.66) v1(29.81,48.84) v1(29.81,46.84) v1(29.81,26.84) v1(30.21,23.83) v1(30.21,21.83) v1(30.21,17.83) v1(30.21,15.83) v1(30.77,7.83) v1(31.81,48.84) v1(31.81,46.84) v1(31.81,44.84) v1(31.81,28.84) v1(32.21,23.83) v1(32.21,19.83) v1(32.21,15.83) v1(32.77,7.83) v1(32.7,2.66) v1(33.81,46.84) v1(33.81,44.84) v1(33.81,26.84) v1(34.21,21.83) v1(34.7,2.66) v1(36.21,11.83) v1(36.7,2.66) v1(37.81,28.84) v1(37.81,26.84) v1(38.21,21.83) v1(38.21,19.83) v1(38.21,17.83) v1(38.7,46.66) v1(38.7,44.66) v1(38.7,2.66) v1(40.21,7.83) v1(40.7,46.66) v1(40.7,2.66) v1(41.81,34.84) v1(41.81,32.84) v1(41.81,30.84) v1(41.81,26.84) v1(42.21,19.83) v1(42.21,17.83) v1(42.21,11.83) v1(42.7,38.66) v1(42.7,2.66) v1(44.7,2.66) v1(46.7,34.66) v1(46.7,2.66) v1(47.23,7.14) v1(48.7,32.66) v1(48.7,2.66) v1(49.23,7.14) v1(50.19,51.1) v1(50.21,25.83) v1(50.21,21.83) v1(50.7,10.66) v1(50.7,2.66) v1(52.19,51.1) v1(52.7,28.66) v1(52.7,26.66) v1(52.7,20.66) v1(52.7,18.66) v1(52.7,10.66) v1(52.7,2.66) v1(53.23,7.14) v1(54.19,51.1) v1(54.7,18.66) v1(54.7,16.66) v1(54.7,10.66) v1(54.7,2.66) v1(55.23,7.14) v1(56.19,51.1) v1(56.7,16.66) v1(56.7,10.66) v1(56.7,2.66) v1(57.23,7.14) v1(58.19,51.1) v1(58.19,37.1) v1(58.7,20.66) v1(58.7,10.66) v1(58.7,2.66) v1(60.19,51.1) v1(60.19,39.1) v1(60.7,20.66) v1(60.7,18.66) v1(60.7,10.66) v1(60.7,2.66) v1(62.19,51.1) v1(62.19,39.1) v1(62.19,33.1) v1(62.7,18.66) v1(62.7,10.66) v1(62.7,2.66) v1(64.19,51.1) v1(64.19,33.1) v1(64.7,18.66) v1(64.7,10.66) v1(64.7,8.66) v1(64.7,2.66) v1(66.19,51.1) v1(66.7,2.66) v1(68.19,51.1) v1(68.7,10.66) v1(68.7,2.66) v1(70.19,51.1) v1(70.19,49.1) v1(70.19,47.1) v1(70.7,18.66) v1(70.7,2.66) v1(72.19,51.1) v1(72.19,49.1) v1(72.19,47.1) v1(72.19,35.1) v1(72.19,33.1) v1(72.7,18.66) v1(72.7,2.66) v1(74.19,35.1) v1(74.19,33.1) v1(74.7,18.66) v1(74.7,2.66) v1(76.19,35.1) v1(76.19,33.1) v1(76.7,16.66) v1(76.7,2.66) v1(78.19,51.1) v1(78.19,47.1) v1(78.19,37.1) v1(78.19,35.1) v1(78.19,33.1) v1(78.7,10.66) v1(78.7,8.66) v1(80.7,10.66) v1(82.7,10.66) v1(84.7,68.66) v1(84.7,66.66) v1(84.7,62.66) v1(84.7,50.66) v1(84.7,10.66) v1(86.7,68.66) v1(86.7,66.66) v1(86.7,62.66) v1(86.7,60.66) v1(86.7,58.66) v1(86.7,52.66) v1(86.7,50.66) v1(86.7,48.66) v1(86.7,46.66) v1(86.7,10.66) v1(88.7,70.66) v1(88.7,68.66) v1(88.7,66.66) v1(88.7,60.66) v1(88.7,58.66) v1(88.7,54.66) v1(88.7,52.66) v1(88.7,50.66) v1(88.7,48.66) v1(88.7,46.66) v1(88.7,44.66) v1(88.7,12.66) v1(90.7,68.66) v1(90.7,66.66) v1(90.7,62.66) v1(90.7,60.66) v1(90.7,58.66) v1(90.7,54.66) v1(90.7,52.66) v1(90.7,50.66) v1(90.7,48.66) v1(90.7,46.66) v1(90.7,44.66) v1(90.7,12.66) v1(92.7,68.66) v1(92.7,66.66) v1(92.7,64.66) v1(92.7,62.66) v1(92.7,60.66) v1(92.7,58.66) v1(92.7,54.66) v1(92.7,52.66) v1(92.7,50.66) v1(92.7,48.66) v1(92.7,46.66) v1(92.7,44.66) v1(92.7,40.66) v1(92.7,38.66) v1(92.7,30.66) v1(92.7,28.66) v1(92.7,18.66) v1(94.7,66.66) v1(94.7,64.66) v1(94.7,62.66) v1(94.7,60.66) v1(94.7,58.66) v1(94.7,56.66) v1(94.7,52.66) v1(94.7,50.66) v1(94.7,48.66) v1(94.7,46.66) v1(94.7,42.66) v1(94.7,40.66) v1(94.7,38.66) v1(94.7,36.66) v1(94.7,28.66) v1(94.7,26.66) v1(94.7,18.66) v1(94.7,16.66) v1(94.7,10.66) v1(96.7,66.66) v1(96.7,64.66) v1(96.7,62.66) v1(96.7,60.66) v1(96.7,58.66) v1(96.7,56.66) v1(96.7,54.66) v1(96.7,34.66) v1(96.7,22.66) v1(96.7,18.66) v1(96.7,16.66) v1(96.7,14.66) v1(96.7,12.66) v1(96.7,10.66) v1(96.7,4.66) v1(98.7,64.66) v1(98.7,62.66) v1(98.7,60.66) v1(98.7,58.66) v1(98.7,56.66) v1(98.7,54.66) v1(98.7,52.66) v1(98.7,36.66) v1(98.7,34.66) v1(98.7,32.66) v1(98.7,26.66) v1(98.7,22.66) v1(98.7,20.66) v1(98.7,18.66) v1(98.7,16.66) v1(98.7,12.66) v1(98.7,6.66) v1(98.7,4.66) v1(100.7,62.66) v1(100.7,60.66) v1(100.7,58.66) v1(100.7,56.66) v1(100.7,54.66) v1(100.7,52.66) v1(100.7,36.66) v1(100.7,34.66) v1(100.7,32.66) v1(100.7,30.66) v1(100.7,28.66) v1(100.7,26.66) v1(100.7,24.66) v1(100.7,22.66) v1(100.7,20.66) v1(100.7,18.66) v1(100.7,16.66) v1(100.7,4.66) v1(102.7,62.66) v1(102.7,60.66) v1(102.7,58.66) v1(102.7,56.66) v1(102.7,54.66) v1(102.7,52.66) v1(102.7,50.66) v1(102.7,48.66) v1(102.7,46.66) v1(102.7,44.66) v1(102.7,42.66) v1(102.7,40.66) v1(102.7,38.66) v1(102.7,36.66) v1(102.7,34.66) v1(102.7,32.66) v1(102.7,30.66) v1(102.7,28.66) v1(102.7,26.66) v1(102.7,24.66) v1(102.7,22.66) v1(102.7,20.66) v1(102.7,18.66) v1(102.7,16.66) v1(102.7,14.66) v1(102.7,12.66) v1(102.7,10.66) v1(102.7,8.66) v1(102.7,6.66) v1(102.7,4.66) v1(104.7,42.66) v1(104.7,40.66) v1(104.7,38.66) v1(104.7,36.66) v1(104.7,34.66) v1(104.7,32.66) v1(104.7,30.66) v1(104.7,28.66) v1(104.7,26.66) v1(104.7,24.66) v1(104.7,22.66) v1(104.7,20.66) v1(104.7,18.66) v1(104.7,16.66) v1(104.7,14.66) v1(104.7,12.66) v1(104.7,10.66) v1(104.7,8.66) v1(104.7,6.66) v1(106.7,14.66) v1(106.7,12.66) v1(106.7,10.66) v1(106.7,8.66) v1(106.7,6.66)
ADC_INA00: length 48
  Top Layer w0.254: 80.89,29.17 80.86,29.14 71.97,29.14 70.28,30.83 70.28,34.75 77.51,41.98 77.51,54.14 U15.16
  Bottom Layer w0.254: U13.2 U15.16
ADC_INA01: length 55.7
  Top Layer w0.254: 83.43,29.17 83.46,29.17 83.49,29.2 83.49,29.21 83.52,29.19 83.75,29.19 83.89,29.05 83.89,28.94 83.63,28.69 82.89,28.69 82.11,27.91 71.78,27.91 69.52,30.17 69.52,34.97 76.94,42.38 76.94,53.97 72.82,58.09 71.44,58.09 69.85,59.67 69.47,59.67 69.46,59.66 U15.15
  Bottom Layer w0.254: U13.3 U15.15
ADC_INA02: length 54.9
  Top Layer w0.254: U15.14 69.08,57.49 72.42,57.49 76.39,53.52 76.39,42.61 68.86,35.08 68.86,29.73 72.13,26.46 80.72,26.46 80.89,26.63
  Bottom Layer w0.254: U13.4 U15.14
ADC_INA03: length 61.2
  Top Layer w0.254: 83.43,26.63 82.13,25.33 71.92,25.33 68.22,29.03 68.22,35.29 75.78,42.85 75.78,53.17 72.05,56.9 67.13,56.9 U15.13
  Bottom Layer w0.254: U13.5 U15.13
ADC_INA04: length 61.2
  Top Layer w0.254: U15.12 65.24,56.25 71.68,56.25 75.11,52.82 75.11,43.04 67.58,35.51 67.58,28.51 72,24.09 80.89,24.09
  Bottom Layer w0.254: U13.6 U15.12
ADC_INA05: length 67.6
  Top Layer w0.254: 83.43,24.09 82.04,22.7 72.14,22.7 67.03,27.81 67.03,35.6 74.45,43.02 74.45,52.58 71.5,55.53 63.42,55.53 U15.11
  Bottom Layer w0.254: U13.7 U15.11
ADC_INA06: length 68.1
  Top Layer w0.254: 80.89,21.55 71.51,21.55 66.31,26.75 66.31,35.69 73.78,43.16 73.78,52.51 71.41,54.88 61.53,54.88 U15.10
  Bottom Layer w0.254: U13.8 U15.10
ADC_INA07: length 74.9
  Top Layer w0.254: 83.43,21.55 82.17,20.29 70.65,20.29 65.76,25.18 65.76,35.89 73.11,43.24 73.11,52.44 71.18,54.38 59.49,54.38 U15.9
  Bottom Layer w0.254: U13.9 U15.9
ADC_INB00: length 63.1
  Bottom Layer w0.254: 83.43,31.71 82.16,32.98 79.42,32.98 76.97,30.53 60.65,30.53 47.61,43.57 47.61,54.21 51.68,58.28 U15.8 U14.9
ADC_INB01: length 60.2
  Bottom Layer w0.254: U14.8 U15.7 49.14,56.65 46.87,54.38 46.87,43.34 60.27,29.94 79.28,29.94 80.89,31.55 80.89,31.71
ADC_INB02: length 74.6
  Bottom Layer w0.254: U14.7 U15.6 46.6,54.79 46.16,54.35 46.16,43.11 61.37,27.9 85.45,27.9 87.44,29.88 87.44,31.85 85.04,34.25 83.43,34.25
ADC_INB03: length 85.6
  Bottom Layer w0.254: U14.6 U15.5 45.55,58.16 45.55,42.86 63.08,25.33 86.87,25.33 88.32,26.78 88.32,32.89 85.8,35.41 82.05,35.41 80.89,34.25
ADC_INB04: length 89.7
  Bottom Layer w0.254: U14.5 U15.4 44.89,56.28 44.89,42.6 64.79,22.7 86.31,22.7 89.21,25.6 89.21,33.34 85.76,36.79 83.43,36.79
ADC_INB05: length 98.9
  Bottom Layer w0.254: 80.89,36.79 82.12,38.02 85.63,38.02 90.07,33.58 90.07,25.26 85.1,20.29 79.84,20.29 78.01,22.12 64.42,22.12 44.18,42.36 44.18,54.45 U15.3 U14.4
ADC_INB06: length 104.6
  Bottom Layer w0.254: U14.3 U15.2 43.53,52.56 43.53,41.96 64.06,21.43 74.7,21.43 78.48,17.65 87.88,17.65 90.72,20.49 90.72,33.88 85.14,39.46 83.56,39.46 83.43,39.33
ADC_INB07: length 112.2
  Bottom Layer w0.254: U14.2 U15.1 42.74,50.81 42.74,41.72 63.78,20.68 74.41,20.68 78.26,16.83 88.06,16.83 91.51,20.28 91.51,34.06 85.05,40.52 82.08,40.52 80.89,39.33
BLUE_L: length 30.6
  Top Layer w0.254: L2.1 L2.2 89.78,64.53 87.49,62.24 87.49,45.93 83.43,41.87
BLUE_R: length 47.8
  Top Layer w0.254: v1(22.4,34.41) 22.4,60.99 L3.1 L3.2
  Bottom Layer w0.254: v1(22.4,34.41) 22.4,31.87 23.84,30.43 25.52,30.43 26.29,29.66 26.29,27.89 27.55,26.63
BUZZ: length 28.3
  Top Layer w0.254: 25.01,31.71 21.1,31.71 20.4,31.01 20.4,30.22 v1(19.88,29.7) ; v1(17.52,27.78) 17.44,27.78 17.26,27.6 17.26,25.23 U6.1
  Bottom Layer w0.254: v1(17.52,27.78) 19.44,29.7 v1(19.88,29.7)
GPIO0: length 83.1
  Top Layer w0.254: v1(21.32,25.97) 21.82,25.47 33.82,25.47 35.02,24.27 39.72,24.27 42.42,21.57 v1(45.32,21.57) ; v1(50.02,28.07) 59.92,37.97 v1(59.92,38.01)
  Bottom Layer w0.254: v1(45.32,21.57) 48.32,24.57 48.32,26.37 v1(50.02,28.07) ; 80.89,44.41 78.46,44.41 72.17,38.11 66.52,38.11 66.45,38.05 65.39,38.05 65.33,38.11 60.02,38.11 v1(59.92,38.01) ; v1(21.32,25.97) 14.92,25.97 12.99,27.9 U4.3
GPIO1: length 81
  Top Layer w0.254: v1(58.02,38.57) 57.82,38.57 v1(48.62,29.37)
  Bottom Layer w0.254: v1(48.62,29.37) 45.82,26.57 42.82,26.57 40.52,24.27 35.12,24.27 33.92,25.47 23.42,25.47 21.92,26.97 16.62,26.97 13.15,30.44 U4.2 ; v1(58.02,38.57) 59.62,36.97 75.55,36.97 80.45,41.87 80.89,41.87
GPIO2: length 22.3
  Bottom Layer w0.254: 93.16,33.13 93.15,33.14 93.15,33.98 83.43,43.7 83.43,44.41 ; 93.16,33.13 93.15,33.13 ; 93.16,33.13 97.4,28.89 U5.3
GPIO3: length 23
  Bottom Layer w0.254: U5.2 97.14,30.7 97.14,31.25 87.52,40.87 87.52,44.12 84.69,46.95 83.43,46.95
GPIO4: length 40.4
  Top Layer w0.254: U2.1 50.35,45.74 R1.2
  Bottom Layer w0.254: U2.1 50.41,44.34 52.99,41.76 70.16,41.76 76.64,48.24 82.18,48.24 83.43,49.49
GPIO5: length 38.5
  Top Layer w0.254: U2.2 52.95,47.27 52.89,47.33
  Bottom Layer w0.254: U2.2 52.95,44.01 54.6,42.36 70.05,42.36 76.4,48.71 77.04,48.71 79.15,50.82 82.22,50.82 83.43,52.03
GPIO6: length 36.5
  Top Layer w0.254: R3.2 55.61,45.8 U2.3 53.57,43.76 48.59,43.76 41.56,50.79 26.25,50.79 25.01,52.03
GPIO7: length 38.9
  Top Layer w0.254: U2.4 58.11,45.76 R4.2 ; 25.01,49.49 26.32,48.18 41.33,48.18 46.92,42.59 54.94,42.59 v1(55.46,43.11)
  Bottom Layer w0.254: v1(55.46,43.11) U2.4
GPIO8: length 38.4
  Top Layer w0.254: 27.55,49.49 41.52,49.49 47.86,43.15 54.37,43.15 55.33,44.11 59,44.11 U2.5 60.63,45.74 R5.2
GPIO9: length 43.5
  Top Layer w0.254: 25.01,46.95 25.11,47.04 25.47,47.04 26.71,45.8 42.63,45.8 46.46,41.97 59.36,41.97 63.06,45.68 U2.6 63.28,45.84 63.28,47.35
GPIO10: length 45.3
  Top Layer w0.254: 25.01,44.41 25.1,44.5 25.67,44.5 27.03,43.14 43.87,43.14 45.6,41.41 61.29,41.41 65.56,45.68 U2.7 65.68,45.7 R7.2
GPIO11: length 47.3
  Top Layer w0.254: 25.01,41.87 26.2,40.68 63.19,40.68 U2.8 68.19,47.27 R8.2
GPIO14: length 122
  Top Layer w0.254: R12.1 U3.12 U3.7 ; v1(21.32,24.77) 21.79,24.77 25.01,21.55
  Bottom Layer w0.254: U3.7 99.34,8.85 95.27,4.77 81.29,4.74 80.57,4.01 19.58,4.01 12.72,10.87 12.72,20.27 17.82,25.37 21.12,25.37 21.32,25.17 v1(21.32,24.77)
GPIO15: length 73.9
  Top Layer w0.254: R10.1 U3.10 U3.3 ; v1(48.42,9.37) 42.22,15.57 v1(34.72,15.57)
  Bottom Layer w0.254: v1(48.42,9.37) 48.72,9.07 61.32,9.07 64.02,6.37 79.62,6.37 82.1,8.85 U3.3 ; v1(34.72,15.57) 28.74,21.55 27.55,21.55
GPIO20: length 20.2
  Bottom Layer w0.254: 27.55,46.95 33.29,41.21 33.29,33.59 U7.3
GPIO21: length 23
  Top Layer w0.254: U7.5 33.39,28.41 v1(32.87,28.41)
  Bottom Layer w0.254: v1(32.87,28.41) 32.51,28.77 32.51,39.45 27.55,44.41
GPIO24: length 25.2
  Top Layer w0.254: U7.13 42.29,27.9 40.12,30.07 40.12,35.94 37.37,38.69 30.05,38.69 28.15,36.79 27.55,36.79
GPIO25: length 32.5
  Top Layer w0.254: 25.01,34.25 25,34.26 25,34.62 25.93,35.55 28.34,35.55 30.75,37.96 37.19,37.96 39.58,35.57 39.58,33.83 v1(39.02,33.27) ; v1(39.72,27.07) 39.74,27.07 43.99,22.82 U7.11
  Bottom Layer w0.254: v1(39.72,27.07) 39.02,27.77 v1(39.02,33.27)
GPIO30: length 104.7
  Top Layer w0.254: U3.4 U3.11 R11.1
  Bottom Layer w0.254: 25.01,24.09 24.92,24.18 18.84,24.18 14.62,19.97 14.62,10.17 20.22,4.57 79.42,4.57 81.36,6.51 89.58,6.51 U3.4
GPIO31: length 107.3
  Top Layer w0.254: R9.1 U3.9 U3.1
  Bottom Layer w0.254: U3.1 89.69,14.02 51.29,14.02 42.53,5.26 20.63,5.26 15.63,10.26 15.63,19.46 18.94,22.77 25.74,22.77 27.15,24.18 27.46,24.18 27.55,24.09
L_LED: length 92.2
  Top Layer w0.254: v1(20.92,40.57) 13.82,47.67 13.82,63.87 18.42,68.47 25.22,68.47 34.12,77.37 60.92,77.37 64.72,73.57 U17.5
  Bottom Layer w0.254: v1(20.92,40.57) 24.7,36.79 25.01,36.79
Q0: length 22.4
  Top Layer w0.254: U11.2 72.06,67.33 72.06,67.87 69.84,70.1 69.17,70.1 69.14,70.07 55.3,70.07 54.72,70.65 U17.15
  Bottom Layer w0.254: U11.2 U16.16
Q1: length 20.6
  Top Layer w0.254: U17.16 53.72,70.2 54.32,69.6 67.13,69.6 U11.3
  Bottom Layer w0.254: U11.3 U16.15
Q2: length 19.3
  Top Layer w0.254: U17.17 52.72,70.16 52.71,70.15 52.71,69.89 53.49,69.12 65.07,69.12 U11.4
  Bottom Layer w0.254: U11.4 U16.14
Q3: length 17.7
  Top Layer w0.254: U11.5 64.38,67.43 63.2,68.61 53.26,68.61 51.9,69.97 51.9,71.17 U17.18
  Bottom Layer w0.254: U11.5 U16.13
Q4: length 17.4
  Top Layer w0.254: v1(50.7,72.79) 50.7,71.37 U17.19
  Bottom Layer w0.254: U16.12 U11.6 57.7,71.41 52.08,71.41 v1(50.7,72.79)
Q5: length 16.6
  Top Layer w0.254: v1(49.71,72.81) 49.71,71.36 U17.20
  Bottom Layer w0.254: v1(49.71,72.81) 49.71,71.53 51.24,70.01 56.56,70.01 U11.7 U16.11
Q6: length 15.8
  Top Layer w0.254: v1(48.65,72.82) 48.65,71.42 U17.21
  Bottom Layer w0.254: v1(48.65,72.82) 48.65,70.77 50.08,69.34 54.89,69.34 56.76,67.47 U11.8 U16.10
Q7: length 14.7
  Top Layer w0.254: v1(47.61,72.85) 47.61,71.46 U17.22
  Bottom Layer w0.254: U16.9 U11.9 53.16,67.27 51.84,68.58 49.03,68.58 47.63,69.99 47.63,72.83 v1(47.61,72.85)
Q8: length 10.3
  Top Layer w0.254: U17.23 46.72,69.47 47.17,69.02 49.93,69.02 U12.9
  Bottom Layer w0.254: U12.9 U16.8
Q9: length 8.8
  Top Layer w0.254: U12.8 48.04,68.37 46.82,68.37 45.72,69.47 U17.24
  Bottom Layer w0.254: U12.8 U16.7
Q10: length 7.4
  Top Layer w0.254: U12.7 46.6,67.47 44.72,69.35 U17.25
  Bottom Layer w0.254: U12.7 U16.6
Q11: length 6.8
  Top Layer w0.254: U12.6 44.06,68.65 43.69,69.02 43.69,71.32 U17.26
  Bottom Layer w0.254: U12.6 U16.5
Q12: length 7.1
  Top Layer w0.254: U12.5 42.72,68.47 U17.27
  Bottom Layer w0.254: U12.5 U16.4
Q13: length 7.8
  Top Layer w0.254: U12.4 41.72,70.01 U17.28
  Bottom Layer w0.254: U12.4 U16.3
Q14: length 9.1
  Top Layer w0.254: U17.29 40.72,70.41 40.17,69.86 39.03,69.86 U12.3
  Bottom Layer w0.254: U12.3 U16.2
Q15: length 10
  Top Layer w0.254: U12.2 37.98,71.35 U17.30
  Bottom Layer w0.254: U12.2 U16.1
R_LED: length 107.5
  Top Layer w0.254: U17.6 63.82,71.45 63.82,73.57 60.77,76.62 34.37,76.62 25.52,67.77 18.62,67.77 14.52,63.67 14.52,48.47 v1(21.62,41.37)
  Bottom Layer w0.254: v1(21.62,41.37) 23.52,43.27 27.82,43.27 31.32,39.77 31.32,32.94 27.55,29.17
S0_S8: length 58.8
  Top Layer w0.254: v1(62.72,72.87) U17.7
  Bottom Layer w0.254: U2.18 55.09,57.98 74.61,57.98 77.32,60.69 77.32,70.67 73.15,74.84 64.44,74.84 62.72,73.13 v1(62.72,72.87)
S1_S9: length 58.9
  Top Layer w0.254: v1(61.75,72.9) 61.75,71.37 U17.8
  Bottom Layer w0.254: U2.17 57.09,57.44 74.8,57.44 77.81,60.45 77.81,70.98 73.33,75.46 64.23,75.46 61.75,72.97 v1(61.75,72.9)
S2_S10: length 58.9
  Top Layer w0.254: U17.9 60.85,71.47 v1(60.85,72.91)
  Bottom Layer w0.254: U2.16 59.14,56.95 74.9,56.95 78.29,60.34 78.29,71.33 73.69,75.93 63.86,75.93 60.85,72.91 v1(60.85,72.91)
S3_S11: length 59.2
  Top Layer w0.254: v1(59.74,72.94) 59.74,71.36 U17.10
  Bottom Layer w0.254: v1(59.74,72.94) 59.95,72.94 63.43,76.42 74.02,76.42 78.77,71.67 78.77,59.99 75.19,56.41 61.2,56.41 58.09,53.3 U2.15
S4_S12: length 59.3
  Top Layer w0.254: U17.11 58.72,72.84 v1(58.82,72.94)
  Bottom Layer w0.254: v1(58.82,72.94) 62.73,76.85 74.4,76.85 79.28,71.97 79.28,59.81 75.34,55.88 63.12,55.88 60.65,53.41 60.65,53.38 U2.14
S5_S13: length 59.6
  Top Layer w0.254: v1(57.77,72.97) 57.77,71.4 U17.12
  Bottom Layer w0.254: U2.13 65.12,55.31 75.58,55.31 79.88,59.61 79.88,71.97 74.39,77.46 62.26,77.46 v1(57.77,72.97)
S6_S14: length 60
  Top Layer w0.254: v1(56.74,72.99) 56.72,72.97 U17.13
  Bottom Layer w0.254: U2.12 67.22,54.87 75.9,54.87 80.51,59.48 80.51,72.12 74.62,78.01 61.76,78.01 v1(56.74,72.99)
S7_S15: length 60.5
  Top Layer w0.254: v1(55.73,73.01) 55.73,71.36 U17.14
  Bottom Layer w0.254: U2.11 68.44,53.55 68.74,53.55 69.57,54.38 76.24,54.38 81.11,59.25 81.11,72.29 74.64,78.76 61.52,78.76 55.77,73.01 v1(55.73,73.01)
VFD_CE: length 23.9
  Inner2 w0.254: 25.01,29.17 26.31,27.87 29.82,27.87 34.92,22.77 34.92,16.87 36.02,15.77 37.42,15.77 38.98,14.21 U10.18
VFD_CLOCK: length 25.3
  Inner2 w0.254: U10.17 41.52,14.77 39.42,16.87 39.42,22.77 38.02,24.17 35.09,24.17 27.55,31.71
VFD_DATA: length 42.8
  Inner2 w0.254: 27.55,41.87 31.65,37.77 37.82,37.77 41.22,34.37 41.22,17.97 43.42,15.77 47.42,15.77 49.14,14.05 U10.14
VFD_RESET: length 34.2
  Top Layer w0.254: v1(20.32,27.97) 20.32,22.27 v1(22.32,20.27)
  Bottom Layer w0.254: v1(20.32,27.97) 21.72,27.97 23.02,29.27 23.02,30.37 21.17,32.22 21.17,34.42 22.22,35.47 25.62,35.47 26.32,36.17 26.32,37.77 27.55,39 27.55,39.33 ; U10.24 22.32,15.35 v1(22.32,20.27)
VFD_RS: length 41.4
  Inner2 w0.254: 25.01,39.33 25.96,39.33 27.09,38.2 30.09,38.2 31.12,37.17 37.02,37.17 40.32,33.87 40.32,17.97 44.36,13.93 U10.15
$1N711: length 42.3
  Top Layer w0.254: v1(54.47,28.21) 65.59,39.33 D1.2
  Bottom Layer w0.254: L1.2 40.25,42.43 v1(54.47,28.21) 54.47,24.28 U1.2
$1N3260: length 88.6
  Top Layer w0.254: U7.14 44.55,30.44 46.12,28.87 46.12,22.47 55.22,13.37 82.32,13.37 86.02,17.07 86.02,36.77 90.82,41.57 94.56,41.57 U9.5
$1N3267: length 93.7
  Top Layer w0.254: U9.6 99.74,44.41 98.58,45.57 96.42,45.57 93.52,42.67 88.82,42.67 84.92,38.77 84.92,17.47 81.72,14.27 55.72,14.27 47.22,22.77 47.22,29.62 44.06,32.78 U7.15
$1N3308: length 80
  Top Layer w0.254: U9.7 95.6,40.07 91.12,40.07 86.82,35.77 86.82,16.57 82.72,12.47 54.72,12.47 46.91,20.28 U7.10
$1N3319: length 78.9
  Top Layer w0.254: U7.9 48.25,17.74 54.42,11.57 83.12,11.57 87.62,16.07 87.62,18.63 87.57,18.68 87.57,27.82 98.62,38.87 98.62,40.27 99.94,41.59 U9.8
$1N3376: length 53
  Top Layer w0.254: v1(19.25,36.73) 19.25,21.56 23.82,16.99 30.61,16.99 U7.6
  Bottom Layer w0.254: v1(19.25,36.73) 19.25,38.84 12.52,45.57 9.37,45.57 8.5,44.7 U8.5
$1N3383: length 47.5
  Top Layer w0.254: v1(18.27,36.79) 18.27,21.81 23.57,16.51 32.67,16.51 U7.7
  Bottom Layer w0.254: U8.6 11.04,44.02 v1(18.27,36.79)
$1N3391: length 34.7
  Top Layer w0.254: v1(21.31,30.43) 33.89,30.43 U7.2
  Bottom Layer w0.254: U8.7 9.79,40.58 11.47,40.58 12.41,39.65 12.41,37.96 19.94,30.43 v1(21.31,30.43)
$1N3400: length 30.2
  Top Layer w0.254: v1(20.16,33.14) 21.45,33.14 21.67,32.92 27.82,32.92 30.42,35.52 U7.1
  Bottom Layer w0.254: U8.8 19.77,33.14 v1(20.16,33.14)

## Copper pours and planes (outline as drawn; the poured copper is in the pictures)
33.8V on Bottom Layer: 8.39,26.48 98.44,26.48 98.44,7.27 8.39,7.27
33.8V on Inner2: 8.5,26.52 98.51,26.52 98.51,7.31 8.5,7.31
AGND on Top Layer: 30.02,77.57 30.02,53.37 85.97,53.37 85.97,57.02 85.92,57.07 81.92,57.07 81.92,75.57 69.02,83.07 39.62,83.07
AGND on Bottom Layer: 39.27,82.82 29.75,77.52 29.75,53.32 85.7,53.32 85.7,57.12 81.75,57.12 81.75,75.52 68.65,82.82
AGND on Inner1: 69,83.35 82.28,75.86 82.28,57.23 84.43,57.23 84.53,57.13 84.53,57.23 84.58,57.18 84.58,53.31 29.8,53.31 29.8,77.85 39.47,83.35
AGND on Inner2: 86.07,53.5 86.07,56.93 86.17,57.03 81.72,57.03 81.72,75.6 74.17,83.14 39.55,83.14 39.51,83.1 35.48,83.1 30.02,77.64 30.02,53.57 30.08,53.51 86.06,53.51
GND on Top Layer: 56.76,7.58 59.31,7.58 59.31,5.04 56.76,5.04
GND on Top Layer: -6.95,88.16 117.09,88.16 117.09,-7.54 -6.95,-7.54
GND on Bottom Layer: -6.59,89.97 116.05,89.97 116.05,-6 -6.59,-6
GND on Inner1: -8.87,93.02 109.89,93.02 109.89,-1.41 -8.87,-1.41
GND on Inner2: -3.18,91.77 111.62,91.77 111.62,-0.93 -3.18,-0.93
$1N296 on Bottom Layer: 59.05,12.07 69.36,12.07 69.36,5.01 59.05,5.01
$1N296 on Inner2: 59.17,12.03 69.43,12.03 69.43,5.02 59.17,5.02

## Text on the board
Top Silkscreen Layer: V | G | D | P | 2025 DC TRACER DUOKSINI | By MAZE 30th PGH
